# Altium schematic sheet MCU and Output Connectors.SchDoc
size 558 x 431 mm; SheetNumber: 8; SheetTotal: 8; SPICEModelCacheSEVJLARZ: <root> / <DocumentId>SEVJLARZ</DocumentId> / <CacheFrame Number="0"> / <Model Name="cap" Kind="MDL"> / <Text>*Default semiconductor capacitor / .MODEL CAP C()</Text> / </Model> / <Model Name="res" Kind="MDL"> / <Text>*Default semiconductor resistor / .MODEL RES R()</Text> / </Model> / </CacheFrame> / </root>
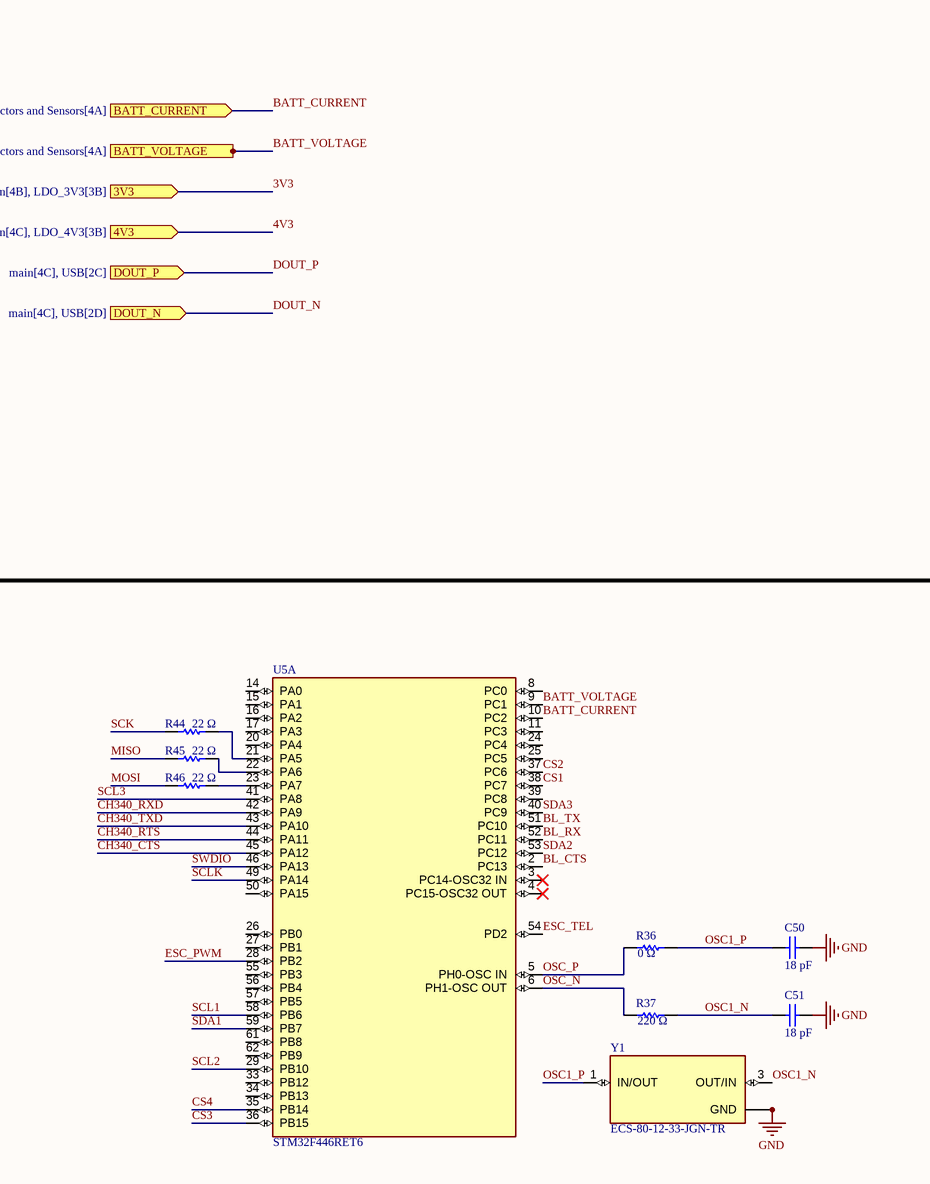
[diagram p0: MCU and Output Connectors.SchDoc, top left]
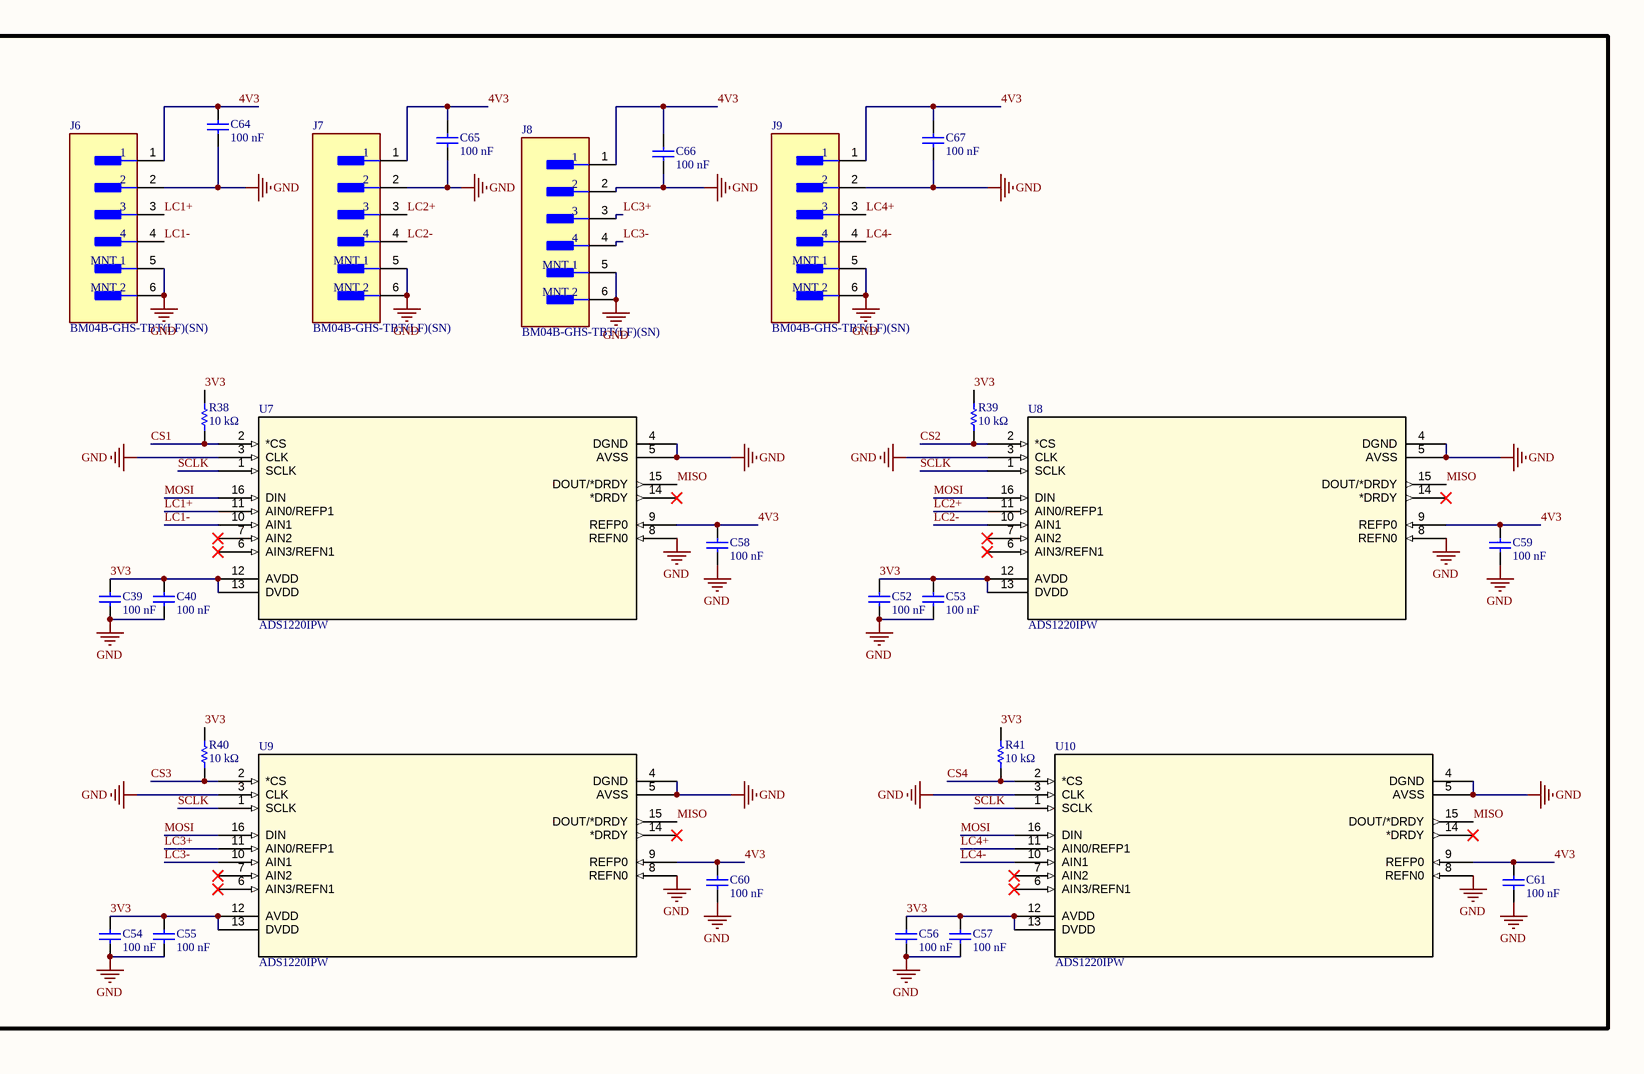
[diagram p1: MCU and Output Connectors.SchDoc, top right]
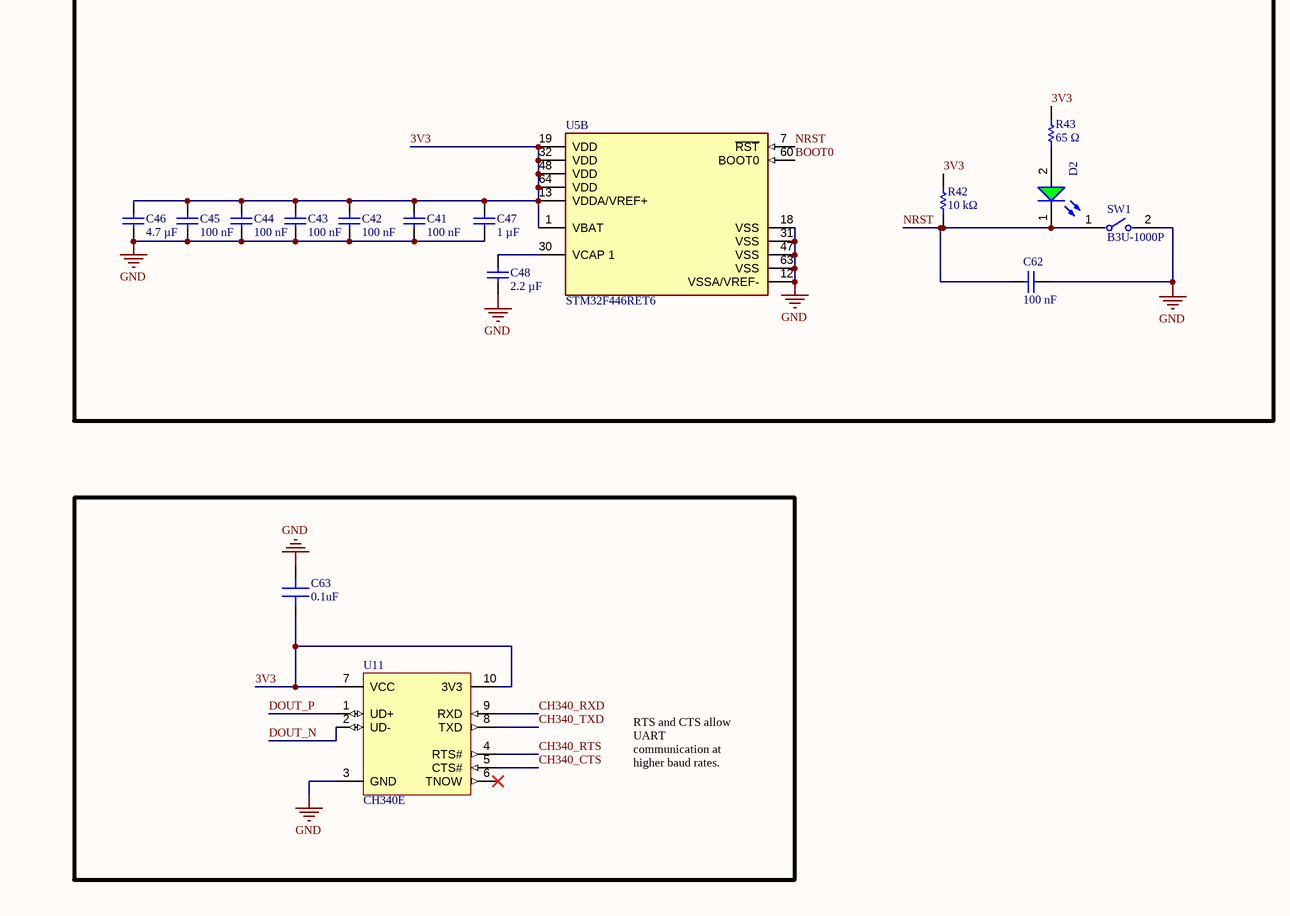
[diagram p2: MCU and Output Connectors.SchDoc, bottom left]
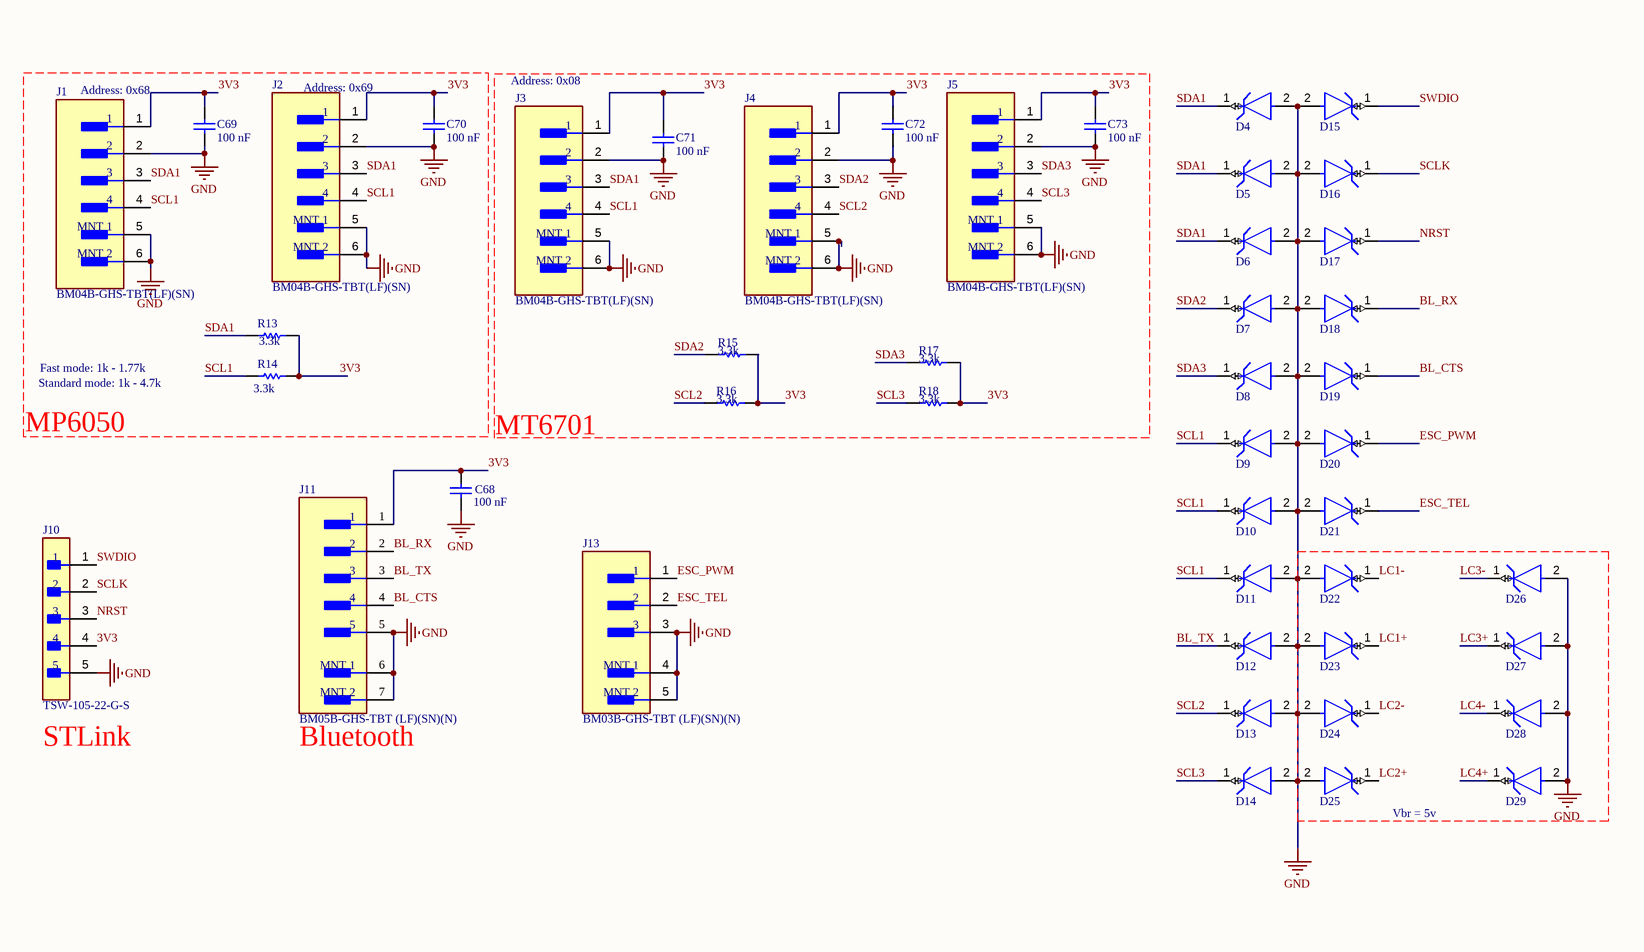
[diagram p3: MCU and Output Connectors.SchDoc, bottom right]

## Parts
C39  value 100 nF  [0402_CAPC1005L]  (hidden comment: Cap Semi)
C40  value 100 nF  [0402_CAPC1005L]  (hidden comment: Cap Semi)
C41  value 100 nF  [0402_CAPC1005L]  (hidden comment: Cap Semi)
C42  value 100 nF  [0402_CAPC1005L]  (hidden comment: Cap Semi)
C43  value 100 nF  [0402_CAPC1005L]  (hidden comment: Cap Semi)
C44  value 100 nF  [0402_CAPC1005L]  (hidden comment: Cap Semi)
C45  value 100 nF  [0402_CAPC1005L]  (hidden comment: Cap Semi)
C46  value 4.7 µF  [0402_CAPC1005L]  (hidden comment: Cap Semi)
C47  value 1 µF  [0402_CAPC1005L]  (hidden comment: Cap Semi)
C48  value 2.2 µF  [0402_CAPC1005L]  (hidden comment: Cap Semi)
C50  value 18 pF  [0402_CAPC1005L]  (hidden comment: Cap Semi)
C51  value 18 pF  [0402_CAPC1005L]  (hidden comment: Cap Semi)
C52  value 100 nF  [0402_CAPC1005L]  (hidden comment: Cap Semi)
C53  value 100 nF  [0402_CAPC1005L]  (hidden comment: Cap Semi)
C54  value 100 nF  [0402_CAPC1005L]  (hidden comment: Cap Semi)
C55  value 100 nF  [0402_CAPC1005L]  (hidden comment: Cap Semi)
C56  value 100 nF  [0402_CAPC1005L]  (hidden comment: Cap Semi)
C57  value 100 nF  [0402_CAPC1005L]  (hidden comment: Cap Semi)
C58  value 100 nF  [0402_CAPC1005L]  (hidden comment: Cap Semi)
C59  value 100 nF  [0402_CAPC1005L]  (hidden comment: Cap Semi)
C60  value 100 nF  [0402_CAPC1005L]  (hidden comment: Cap Semi)
C61  value 100 nF  [0402_CAPC1005L]  (hidden comment: Cap Semi)
C62  100 nF  [0402_CAPC1005L]
C63  0.1uF  [IPC C C0402 NO SILK]
C64  value 100 nF  [0402_CAPC1005L]  (hidden comment: Cap Semi)
C65  value 100 nF  [0402_CAPC1005L]  (hidden comment: Cap Semi)
C66  value 100 nF  [0402_CAPC1005L]  (hidden comment: Cap Semi)
C67  value 100 nF  [0402_CAPC1005L]  (hidden comment: Cap Semi)
C68  value 100 nF  [0402_CAPC1005L]  (hidden comment: Cap Semi)
C69  value 100 nF  [0402_CAPC1005L]  (hidden comment: Cap Semi)
C70  value 100 nF  [0402_CAPC1005L]  (hidden comment: Cap Semi)
C71  value 100 nF  [0402_CAPC1005L]  (hidden comment: Cap Semi)
C72  value 100 nF  [0402_CAPC1005L]  (hidden comment: Cap Semi)
C73  value 100 nF  [0402_CAPC1005L]  (hidden comment: Cap Semi)
D2  150060VS75000  [WL-SMCW_0603_150060xx75000]  (value not drawn)
D4  ESD321DPYR  [FP-DPY0002A-MFG]  (value not drawn)
D5  ESD321DPYR  [FP-DPY0002A-MFG]  (value not drawn)
D6  ESD321DPYR  [FP-DPY0002A-MFG]  (value not drawn)
D7  ESD321DPYR  [FP-DPY0002A-MFG]  (value not drawn)
D8  ESD321DPYR  [FP-DPY0002A-MFG]  (value not drawn)
D9  ESD321DPYR  [FP-DPY0002A-MFG]  (value not drawn)
D10  ESD321DPYR  [FP-DPY0002A-MFG]  (value not drawn)
D11  ESD321DPYR  [FP-DPY0002A-MFG]  (value not drawn)
D12  ESD321DPYR  [FP-DPY0002A-MFG]  (value not drawn)
D13  ESD321DPYR  [FP-DPY0002A-MFG]  (value not drawn)
D14  ESD321DPYR  [FP-DPY0002A-MFG]  (value not drawn)
D15  ESD321DPYR  [FP-DPY0002A-MFG]  (value not drawn)
D16  ESD321DPYR  [FP-DPY0002A-MFG]  (value not drawn)
D17  ESD321DPYR  [FP-DPY0002A-MFG]  (value not drawn)
D18  ESD321DPYR  [FP-DPY0002A-MFG]  (value not drawn)
D19  ESD321DPYR  [FP-DPY0002A-MFG]  (value not drawn)
D20  ESD321DPYR  [FP-DPY0002A-MFG]  (value not drawn)
D21  ESD321DPYR  [FP-DPY0002A-MFG]  (value not drawn)
D22  SP0402U-ULC-01ETG  [FP-DPY0002A-MFG]  (value not drawn)
D23  SP0402U-ULC-01ETG  [FP-DPY0002A-MFG]  (value not drawn)
D24  SP0402U-ULC-01ETG  [FP-DPY0002A-MFG]  (value not drawn)
D25  SP0402U-ULC-01ETG  [FP-DPY0002A-MFG]  (value not drawn)
D26  SP0402U-ULC-01ETG  [FP-DPY0002A-MFG]  (value not drawn)
D27  SP0402U-ULC-01ETG  [FP-DPY0002A-MFG]  (value not drawn)
D28  SP0402U-ULC-01ETG  [FP-DPY0002A-MFG]  (value not drawn)
D29  SP0402U-ULC-01ETG  [FP-DPY0002A-MFG]  (value not drawn)
J1  BM04B-GHS-TBT(LF)(SN)  [FP-BM04B-GHS-TBT_LF_SN-MFG]
J2  BM04B-GHS-TBT(LF)(SN)  [FP-BM04B-GHS-TBT_LF_SN-MFG]
J3  BM04B-GHS-TBT(LF)(SN)  [FP-BM04B-GHS-TBT_LF_SN-MFG]
J4  BM04B-GHS-TBT(LF)(SN)  [FP-BM04B-GHS-TBT_LF_SN-MFG]
J5  BM04B-GHS-TBT(LF)(SN)  [FP-BM04B-GHS-TBT_LF_SN-MFG]
J6  BM04B-GHS-TBT(LF)(SN)  [FP-BM04B-GHS-TBT_LF_SN-MFG]
J7  BM04B-GHS-TBT(LF)(SN)  [FP-BM04B-GHS-TBT_LF_SN-MFG]
J8  BM04B-GHS-TBT(LF)(SN)  [FP-BM04B-GHS-TBT_LF_SN-MFG]
J9  BM04B-GHS-TBT(LF)(SN)  [FP-BM04B-GHS-TBT_LF_SN-MFG]
J10  TSW-105-22-G-S  [FP-TSW-105-22-G-S-MFG]
J11  BM05B-GHS-TBT (LF)(SN)(N)  [FP-BM05B-GHS-TBT_LF_SN-MFG]
J13  BM03B-GHS-TBT (LF)(SN)(N)  [FP-BM03B-GHS-TBT_LF_SN-MFG]
R13  value 3.3k  [0402_RESC1005L]  (hidden comment: Res Semi)
R14  value 3.3k  [0402_RESC1005L]  (hidden comment: Res Semi)
R15  value 3.3k  [0402_RESC1005L]  (hidden comment: Res Semi)
R16  value 3.3k  [0402_RESC1005L]  (hidden comment: Res Semi)
R17  value 3.3k  [0402_RESC1005L]  (hidden comment: Res Semi)
R18  value 3.3k  [0402_RESC1005L]  (hidden comment: Res Semi)
R36  value 0 Ω  [0402_RESC1005L]  (hidden comment: Res Semi)
R37  value 220 Ω  [0402_RESC1005L]  (hidden comment: Res Semi)
R38  value 10 kΩ  [0402_RESC1005L]  (hidden comment: Res Semi)
R39  value 10 kΩ  [0402_RESC1005L]  (hidden comment: Res Semi)
R40  value 10 kΩ  [0402_RESC1005L]  (hidden comment: Res Semi)
R41  value 10 kΩ  [0402_RESC1005L]  (hidden comment: Res Semi)
R42  value 10 kΩ  [0402_RESC1005L]  (hidden comment: Res Semi)
R43  value 65 Ω  [0603_RESC1608L]  (hidden comment: Res Semi)
R44  value 22 Ω  [0402_RESC1005L]  (hidden comment: Res Semi)
R45  value 22 Ω  [0402_RESC1005L]  (hidden comment: Res Semi)
R46  value 22 Ω  [0402_RESC1005L]  (hidden comment: Res Semi)
SW1  B3U-1000P  [FP-B3U-1000P-MFG]
U5  STM32F446RET6  [FP-LQFP64-5W-MFG]  (parts A,B of 2)
U7  ADS1220IPW  [PW16]
U8  ADS1220IPW  [PW16]
U9  ADS1220IPW  [PW16]
U10  ADS1220IPW  [PW16]
U11  CH340E  [MSOP-UN10_L]
Y1  ECS-80-12-33-JGN-TR  [XTAL_ECS-240-8-33-AGN-TR]

## Ports
3V3 (in, see main[4B], LDO_3V3[3B]), 4V3 (in, see main[4C], LDO_4V3[3B]), BATT_CURRENT (in, see main[4C], Input Connectors and Sensors[4A]), BATT_VOLTAGE (in, see main[4C], Input Connectors and Sensors[4A]), DOUT_N (in, see main[4C], USB[2D]), DOUT_P (in, see main[4C], USB[2C])

## Nets
GND: C39.2 C40.2 C41.2 C42.2 C43.2 C44.2 C45.2 C46.2 C47.2 C48.2 C50.1 C51.2 C52.2 C53.2 C54.2 C55.2 C56.2 C57.2 C58.2 C59.2 C60.2 C61.2 C62.1 C63.1 C64.2 C65.2 C66.2 C67.2 C68.2 C69.2 C70.2 C71.2 C72.2 C73.2 D4.2(GND) D5.2(GND) D6.2(GND) D7.2(GND) D8.2(GND) D9.2(GND) D10.2(GND) D11.2(GND) D12.2(GND) D13.2(GND) D14.2(GND) D15.2(GND) D16.2(GND) D17.2(GND) D18.2(GND) D19.2(GND) D20.2(GND) D21.2(GND) D22.2(GND) D23.2(GND) D24.2(GND) D25.2(GND) D26.2(GND) D27.2(GND) D28.2(GND) D29.2(GND) J1.2 J1.5(MNT_1) J1.6(MNT_2) J2.2 J2.5(MNT_1) J2.6(MNT_2) J3.2 J3.5(MNT_1) J3.6(MNT_2) J4.2 J4.5(MNT_1) J4.6(MNT_2) J5.2 J5.5(MNT_1) J5.6(MNT_2) J6.2 J6.5(MNT_1) J6.6(MNT_2) J7.2 J7.5(MNT_1) J7.6(MNT_2) J8.2 J8.5(MNT_1) J8.6(MNT_2) J9.2 J9.5(MNT_1) J9.6(MNT_2) J10.5 J11.5 J11.6(MNT_1) J11.7(MNT_2) J13.3 J13.4(MNT_1) J13.5(MNT_2) SW1.2 U5.12(VSSA/VREF-) U5.18(VSS) U5.31(VSS) U5.47(VSS) U5.63(VSS) U7.3(CLK) U7.4(DGND) U7.5(AVSS) U7.8(REFN0) U8.3(CLK) U8.4(DGND) U8.5(AVSS) U8.8(REFN0) U9.3(CLK) U9.4(DGND) U9.5(AVSS) U9.8(REFN0) U10.3(CLK) U10.4(DGND) U10.5(AVSS) U10.8(REFN0) U11.3(GND) Y1.2(GND) Y1.4(GND)
3V3: C39.1 C40.1 C41.1 C42.1 C43.1 C44.1 C45.1 C46.1 C47.1 C52.1 C53.1 C54.1 C55.1 C56.1 C57.1 C63.2 C68.1 C69.1 C70.1 C71.1 C72.1 C73.1 J1.1 J2.1 J3.1 J4.1 J5.1 J10.4 J11.1 R13.2 R14.2 R15.2 R16.2 R17.2 R18.2 R38.2 R39.2 R40.2 R41.2 R42.2 R43.1 U5.1(VBAT) U5.13(VDDA/VREF+) U5.19(VDD) U5.32(VDD) U5.48(VDD) U5.64(VDD) U7.12(AVDD) U7.13(DVDD) U8.12(AVDD) U8.13(DVDD) U9.12(AVDD) U9.13(DVDD) U10.12(AVDD) U10.13(DVDD) U11.7(VCC) U11.10(3V3) ; port 3V3
4V3: C58.1 C59.1 C60.1 C61.1 C64.1 C65.1 C66.1 C67.1 J6.1 J7.1 J8.1 J9.1 U7.9(REFP0) U8.9(REFP0) U9.9(REFP0) U10.9(REFP0) ; port 4V3
\: D21.1(IO) J13.2 U5.54(PD2)  [also labelled ESC_TEL]
BATT_CURRENT: U5.10(PC2) ; port BATT_CURRENT
BATT_VOLTAGE: U5.9(PC1) ; port BATT_VOLTAGE
BL_CTS: D19.1(IO) J11.4 U5.2(PC13)
BL_RX: D18.1(IO) J11.2 U5.52(PC11)
BL_TX: D12.1(IO) J11.3 U5.51(PC10)
BOOT0: U5.60(BOOT0)
CH340_CTS: U5.45(PA12) U11.5(CTS#)
CH340_RTS: U5.44(PA11) U11.4(RTS#)
CH340_RXD: U5.42(PA9) U11.9(RXD)
CH340_TXD: U5.43(PA10) U11.8(TXD)
CS1: R38.1 U5.38(PC7) U7.2(*CS)
CS2: R39.1 U5.37(PC6) U8.2(*CS)
CS3: R40.1 U5.36(PB15) U9.2(*CS)
CS4: R41.1 U5.35(PB14) U10.2(*CS)
DOUT_N: U11.2(UD-) ; port DOUT_N
DOUT_P: U11.1(UD+) ; port DOUT_P
ESC_PWM: D20.1(IO) J13.1 U5.28(PB2)
LC1+: D23.1(IO) J6.3 U7.11(AIN0/REFP1)
LC1-: D22.1(IO) J6.4 U7.10(AIN1)
LC2+: D25.1(IO) J7.3 U8.11(AIN0/REFP1)
LC2-: D24.1(IO) J7.4 U8.10(AIN1)
LC3+: D27.1(IO) J8.3 U9.11(AIN0/REFP1)
LC3-: D26.1(IO) J8.4 U9.10(AIN1)
LC4+: D29.1(IO) J9.3 U10.11(AIN0/REFP1)
LC4-: D28.1(IO) J9.4 U10.10(AIN1)
MISO: R45.2 U7.15(DOUT/*DRDY) U8.15(DOUT/*DRDY) U9.15(DOUT/*DRDY) U10.15(DOUT/*DRDY)
MOSI: R46.2 U7.16(DIN) U8.16(DIN) U9.16(DIN) U10.16(DIN)
NRST: C62.2 D2.1(K) D17.1(IO) J10.3 R42.1 SW1.1 U5.7(~{RST})
OSC1_N: C51.1 R37.2 Y1.3(OUT/IN)
OSC1_P: C50.2 R36.2 Y1.1(IN/OUT)
OSC_N: R37.1 U5.6(PH1-OSC_OUT)
OSC_P: R36.1 U5.5(PH0-OSC_IN)
SCK: R44.2
SCL1: D9.1(IO) D10.1(IO) D11.1(IO) J1.4 J2.4 J3.4 R14.1 U5.58(PB6)
SCL2: D13.1(IO) J4.4 R16.1 U5.29(PB10)
SCL3: D14.1(IO) J5.4 R18.1 U5.41(PA8)
SCLK: D16.1(IO) J10.2 U5.49(PA14) U7.1(SCLK) U8.1(SCLK) U9.1(SCLK) U10.1(SCLK)
SDA1: D4.1(IO) D5.1(IO) D6.1(IO) J1.3 J2.3 J3.3 R13.1 U5.59(PB7)
SDA2: D7.1(IO) J4.3 R15.1 U5.53(PC12)
SDA3: D8.1(IO) J5.3 R17.1 U5.40(PC9)
SWDIO: D15.1(IO) J10.1 U5.46(PA13)
NetC48_1: C48.1 U5.30(VCAP_1)
NetD2_2: D2.2(A) R43.2
NetR44_1: R44.1 U5.21(PA5)
NetR45_1: R45.1 U5.22(PA6)
NetR46_1: R46.1 U5.23(PA7)

Not connected (* = marked no-connect by the designer): U5 3(PC14-OSC32_IN)* 4(PC15-OSC32_OUT)* 8(PC0) 11(PC3) 14(PA0) 15(PA1) 16(PA2) 17(PA3) 20(PA4) 24(PC4) 25(PC5) 26(PB0) 27(PB1) 33(PB12) 34(PB13) 39(PC8) 50(PA15) 55(PB3) 56(PB4) 57(PB5) 61(PB8) 62(PB9); U7 6(AIN3/REFN1)* 7(AIN2)* 14(*DRDY)*; U8 6(AIN3/REFN1)* 7(AIN2)* 14(*DRDY)*; U9 6(AIN3/REFN1)* 7(AIN2)* 14(*DRDY)*; U10 6(AIN3/REFN1)* 7(AIN2)* 14(*DRDY)*; U11 6(TNOW)*

## Notes on the sheet
- (near J1) Address: 0x68
- (near J2) Address: 0x69
- (near J3) Address: 0x08
- Fast mode: 1k - 1.77k
- MP6050
- Standard mode: 1k - 4.7k
- (near C68) MT6701
- (near J10) STLink
- (near J11) Bluetooth
- (near D25) Vbr = 5v
- RTS and CTS allow UART communication at higher baud rates.
- DWG. NO.
- REV.
- SHT.
- REVISION
- DESCRIPTION
- DATE
- APPROVED
- THIS DOCUMENT AND THE DATA DISCLOSED HEREIN OR HEREWITH IS THE PROPERTY OF ALTIUM LIMITED AND MAY BE FREELY DISTRIBUTED IN WHOLE. NO RIGHTS ARE RESERVED OR EXPRESS OR IMPLIED WARANTEE GIVEN.
- ENG:
- DSN:
- APPROVALS
- PROJECT
- DOCUMENT REVISION:
- DESIGN ITEM:
- CHK:
- BOM:
- REFERENCE DOCUMENTS
- PROJECT REVISION:
- TITLE
- FAB DWG:
- PCB DWG:
- ASSY DWG:
- SCALE:
- SIZE
- C
- CAGE CODE
- FILE NAME
- DWG NO.
- SHEET
- OF
- REV

## Library data of the parts
C39-C48 C50-C62 C64-C73 = Cap Semi: Capacitor (Semiconductor SIM Model); Published: 8-Jun-2000; LatestRevisionDate: 29-May-2009; LatestRevisionNote: IPC-7351 Footprint Added.; PackageReference: C1206; Publisher: Altium Limited; PackageDescription: Chip Capacitor; Digikey part#: *; Manufacturer: *; Manufacturer part#: *
  C62: Value: 100 nF
C63 = CMP-002-000000-4: Generic CAP 0402; Value: ?F; Source: Schlib1.SchLib; Design Item ID: Generic CAP 0402
D2 = CMP-1426-00006-8: LED Uni-Color Green 572nm 2-Pin Chip 0603(1608Metric) T/R; Manufacturer Lifecycle Status: ACTIVE; Wavelength: 570nm; Forward Current: 100mA; Test Current: 20mA; YEOL: 1 = Estimated lifetime > 10 years; Forward Voltage: 2V; Max Reverse Voltage (DC): 5V; Lens Style: Clear, Rectangular; Max Junction Temperature (Tj): 95°C; Luminous Intensity: 40mcd; Viewing Angle: 140°; Power Dissipation: 72mW; Width: 800µm; REACH SVHC: Unknown; Number of Pins: 2; Max Operating Temperature: 85°C; Mount: Surface Mount; RoHS: Compliant; Case/Package: 0603; Lifecycle Status: Production; Case Code (Metric): 1608; Peak Wavelength: 572nm; Dominant Wavelength: 570nm; Length: 1.6mm; Height: 700µm; Reverse Voltage: 5V; Packaging: Tape and Reel; Color: Green; Case Code (Imperial): 0603; Min Operating Temperature: -40°C
D4-D21 = CMP-04989-000001-1: HDMI2.0 ESD PROTECTION; Manufacturer: Texas Instruments; Standoff Height: 0mm; Peak Pulse Current: 6A; Value: 0.9pF; Number Of Channels: 1; Reverse Standoff Voltage: 3.6V; Peak Pulse Power: 40W; Breakdown Voltage: 4.5V; Direction: Unidirectional; Clamping Voltage: 6.8V; RoHS: TRUE; Temperature: -40°C to +125°C; Package: DPY0002A; Temperature Range Low: -40°C; Temperature Range High: +125°C; Category: Diode; Capacitance: 0.9pF; Ambient Temperature Range Low: -40°C; Device Class L3: unset; Device Class L1: Circuit Protection; Ambient Temperature Range High: +125°C; ComponentLink2URL: http://www.ti.com/lit/ds/symlink/esd321.pdf; Octopart: https://octopart.com/esd321dpyr-texas+instruments-94354200; Manufacturer Part Number: ESD321DPYR; Digikey Description: HDMI2.0 ESD PROTECTION; Lead Free: Yes; ComponentLink2Description: Datasheet; Device Class L2: TVS Diodes; Height: 0.45mm; Automotive: No
D22-D29 = CMP-04989-000001-1: TVS DIODE 5VWM 9.2VC 0402/2DFN; Manufacturer Part Number: ESD321DPYR; Manufacturer: Texas Instruments; Standoff Height: 0mm; Peak Pulse Current: 6A; Value: 0.9pF; Number Of Channels: 1; Reverse Standoff Voltage: 3.6V; Peak Pulse Power: 40W; Breakdown Voltage: 4.5V; Direction: Unidirectional; Clamping Voltage: 6.8V; RoHS: TRUE; Temperature: -40°C to +125°C; Package: DPY0002A; Temperature Range Low: -40°C; Temperature Range High: +125°C; Category: Diode; Capacitance: 0.9pF; Ambient Temperature Range Low: -40°C; Device Class L3: unset; Device Class L1: Circuit Protection; Ambient Temperature Range High: +125°C; ComponentLink2URL: http://www.ti.com/lit/ds/symlink/esd321.pdf; Octopart: https://octopart.com/esd321dpyr-texas+instruments-94354200; Digikey Description: HDMI2.0 ESD PROTECTION; Lead Free: Yes; ComponentLink2Description: Datasheet; Device Class L2: TVS Diodes; Height: 0.45mm; Automotive: No
J1-J9 = CMP-17439-000062-2: CONN HEADER SMD 4POS 1.25MM; Number of Positions: 4; Wire/Cable Gauge: 26AWG; Current Rating: 1A; Voltage Rating (AC): 50V; Gender: Male; Orientation: Straight; Max Operating Temperature: 85°C; Pitch: 1.25mm; Contact Plating: Tin; Number of Rows: 4; Series: GH; Min Operating Temperature: -25°C; REACH SVHC: No SVHC; Packaging: Cut Tape; Lead Free: Lead Free; Voltage Rating: 50V; Contact Material: Bronze; Number of Contacts: 4; Termination: Crimp; Case/Package: SMD/SMT; Housing Color: Natural; Housing Material: Nylon
J10 = CMP-02766-000105-1: CONN HEADER VERT 5POS 2.54MM; Gender: Male; Number of Contacts: 5; Contact Plating: Gold; Mount: Through Hole; REACH SVHC: No SVHC; Number of Rows: 1; Contact Material: Bronze; Termination: Through Hole
J11 = CMP-17439-000467-1: CONN HEADER SMD 5POS 1.25MM; Pitch: 0.049inch; Number of Positions: 5; Mated Stacking Heights: 7.3mm; Voltage Rating: 50V; Contact Material: Bronze; Number of Pins: 5; Contact Type: Outer Shroud Contact; Lead Free: Lead Free; Insulation Material: Nylon; Flammability Rating: UL94 V-0; Min Operating Temperature: -25°C; Series: GH; Mount: Surface Mount; Number of Rows: 1; Color: Natural; Packaging: Cut Tape; Contact Shape: Rectangular; Contact Plating: Tin; Contact Finish - Mating: TIN; Connector Type: Header; Insulation Color: Natural; Fastening Type: Ramp; Termination: Solder; Max Operating Temperature: 85°C
J13 = CMP-17439-000616-1: CONN HEADER SMD 3POS 1.25MM; Mated Stacking Heights: 7.3mm; Voltage Rating: 50V; Pitch: 0.049inch; Number of Positions: 3; Contact Material: Bronze; Number of Rows: 1; Packaging: Cut Tape; Fastening Type: Ramp; Contact Shape: Rectangular; Termination: Solder; Flammability Rating: UL94 V-0; Lead Free: Lead Free; Color: Natural; Mount: Surface Mount; Contact Finish - Mating: TIN; Max Operating Temperature: 85°C; Series: GH; Insulation Color: Natural; Connector Type: Header; Insulation Material: Nylon; Contact Type: Outer Shroud Contact; Min Operating Temperature: -25°C; Contact Plating: Tin
R13-R18 R36-R41 R43 = Res Semi: Semiconductor Resistor; Published: 8-Jun-2000; LatestRevisionDate: 17-Jul-2002; LatestRevisionNote: Re-released for DXP Platform.; PackageReference: AXIAL-0.5; Publisher: Altium Limited; Digikey part#: *; Manufacturer: *; Manufacturer part#: *
R42 R44-R46 = Res Semi: Semiconductor Resistor 1%; Published: 8-Jun-2000; LatestRevisionDate: 17-Jul-2002; LatestRevisionNote: Re-released for DXP Platform.; PackageReference: AXIAL-0.5; Publisher: Altium Limited; Digikey part#: *; Manufacturer: *; Manufacturer part#: *
SW1 = CMP-2100-03586-2: SWITCH TACTILE SPST-NO 0.05A 12V; Contact Resistance: 100mR; Operating Force: 1.5N; Max Current Rating: 50mA; Switch Travel: 0.15mm; Actuator Type: Standard; Mechanical Life: 200000Cycles; Ratings: Dust Proof; Illumination Type: Non-Illuminated; Throw Configuration: SPST; Actuator Length: 0.4mm; Switch Function: Off-Mom; Height: 1.2mm; Width: 3mm; Weight: 0.000776oz; Contact Material: Silver; Max Voltage Rating (DC): 12V; Insulation Resistance: 100MR; Lead Free: Lead Free; Current Rating: 50mA; Termination: SMD/SMT; Length: 4mm; Voltage Rating (DC): 12V; Contact Current Rating: 50mA; Orientation: Straight; Depth: 2.5mm; Max Operating Temperature: 70°C; Packaging: Tape and Reel; Min Operating Temperature: -25°C; Package Quantity: 1; Mount: Surface Mount; Electrical Life: 200000Cycles
U5 = CMP-12105-000007-1: IC MCU 32BIT 512KB FLASH 64LQFP; Manufacturer: ST; Number Of Spi Channels: 4; Ram Size: 128KBytes; Standoff Height: 0.05mm; Number Of Uart Channels: 6; Number Of Pwm Channels: 32; Max Junction Temp: +105°C; Number Of I/Os: 50; Number Of Usb Channels: 2; Frequency: 180MHz; Number Of A/D Converters: 3; Max Supply Voltage: 3.6V; Number Of Adc Channels: 16; Interface: I2C,SPI,UART,USART,CAN,USB,LIN,IrDA,I2S,Other; Memory Size: 512KBytes; Number Of Timers/Counters: 14; Min Supply Voltage: 1.7V; Core Architecture: ARM Cortex-M4; Data Bus Width: 32bits; Number Of Cores: 1; Ambient Temperature Range Low: -40°C; ComponentLink2URL: https://www.st.com/en/microcontrollers-microprocessors/stm32f446re.html; Category: IC; Height: 1.6mm; Ipc Land Pattern Name: QFP50P1200X1200X160-64; Manufacturer Part Number: STM32F446RET6; Octopart: https://octopart.com/stm32f446ret6-stmicroelectronics-52642920; Temperature Range High: +105°C; Lead Free: Yes; Mouser Description: ARM Microcontrollers - MCU High-performance and DSP with FP, ARM Cortex-M4 MCU with 512 Kbytes Flash, 180 MHz CPU, Art Accelerator, SDRAM; Digikey Description: IC MCU 32BIT 512KB FLASH 64LQFP; Ambient Temperature Range High: +85°C; Number Of I2C Channels: 4; Memory Type: FLASH; RoHS: TRUE; Automotive: No; Device Class L1: Integrated Circuits (ICs); Temperature: -40°C to +105°C; Device Class L2: Embedded Processors and Controllers; Device Class L3: Microcontrollers; Temperature Range Low: -40°C; Package: LQFP64-5W; ComponentLink2Description: Datasheet
U7-U10 = ADS1220IPW: 24-bit, 2-kSPS, four-channel, low-power, delta-sigma ADC with PGA, VREF, SPI and two IDACs 16-TSSOP -40 to 125; Manufacturer_Name: Texas Instruments; Copyright: Copyright (C) 2025 Ultra Librarian. All rights reserved.; Manufacturer_Part_Number: ADS1220IPW; RefDes: RefDes; Type: Type
U11 = CMP-010-000001-1: Source: Schlib1.SchLib; Design Item ID: CH340E
Y1 = ECS-80-12-33-JGN-TR: 8 MHz Â±20ppm Crystal 12pF 400 Ohms 4-SMD, No Lead; MF: ECS Inc.; SnapEDA_Link: https://www.snapeda.com/parts/ECS-80-12-33-JGN-TR/ECS/view-part/?ref=snap; Package: ECX-32-33-4 ECS; Value: *; MP: ECS-80-12-33-JGN-TR; Check_prices: https://www.snapeda.com/parts/ECS-80-12-33-JGN-TR/ECS/view-part/?ref=eda